# Altium schematic sheet AND_5_entradas.SchDoc
size A4; PageSetup: Record=PageOptions|CenterHorizontal=True|CenterVertical=True|PrintScale=0.97|XCorrection=1.00|YCorrection=1.00|PrintKind=2|BorderSize=5000000|LeftOffset=0|BottomOffset=0|Orientation=2|PaperLength=1000|PaperWidth=1000|Scale=100|PaperSource=7|PrintQuality=-4|MediaType=1|DitherType=10|PaperKind=A4|PrintScaleMode=1
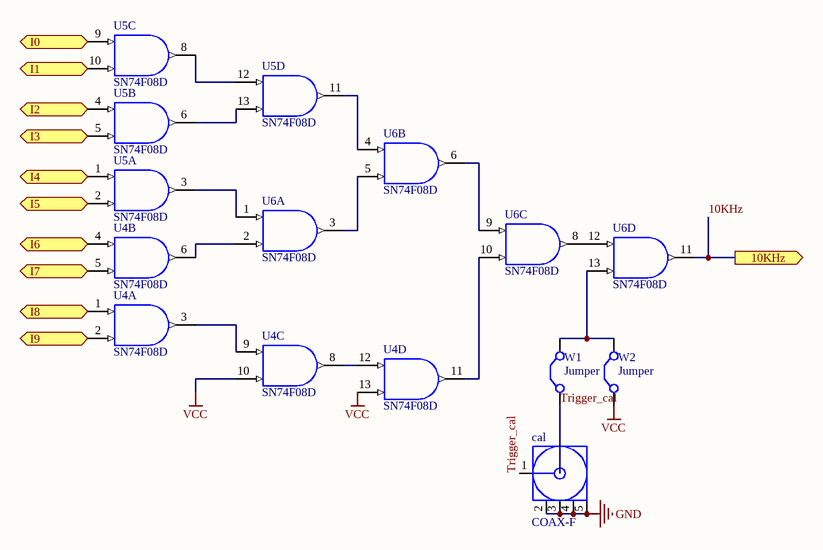
[diagram p0: AND_5_entradas.SchDoc]

## Parts
cal  COAX-F  [MCX5.08-H5]
U4  SN74F08D  [D014_N]  (parts A,B,C,D of 4)
U5  SN74F08D  [D014_N]  (parts A,B,C,D of 4)
U6  SN74F08D  [D014_N]  (parts A,B,C,D of 4)
W1  Jumper  [RAD-0.2]
W2  Jumper  [RAD-0.2]

## Ports
10KHz (out), I0 (in), I1 (in), I2 (in), I3 (in), I4 (in), I5 (in), I6 (in), I7 (in), I8 (in), I9 (in)

## Nets
GND: cal.2(GND) cal.3(GND) cal.4(GND) cal.5(GND) U4.7(GND) U5.7(GND) U6.7(GND)
VCC: U4.10(B) U4.13(B) U4.14(VCC) U5.14(VCC) U6.14(VCC) W2.1(C1)
10KHz: U6.11(Y) ; port 10KHz
I0: U5.9(A) ; port I0
I1: U5.10(B) ; port I1
I2: U5.4(A) ; port I2
I3: U5.5(B) ; port I3
I4: U5.1(A) ; port I4
I5: U5.2(B) ; port I5
I6: U4.4(A) ; port I6
I7: U4.5(B) ; port I7
I8: U4.1(A) ; port I8
I9: U4.2(B) ; port I9
Trigger_cal: cal.1(Signal) W1.1(C1)
NetU4_3: U4.3(Y) U4.9(A)
NetU4_6: U4.6(Y) U6.2(B)
NetU4_8: U4.8(Y) U4.12(A)
NetU4_11: U4.11(Y) U6.10(B)
NetU5_3: U5.3(Y) U6.1(A)
NetU5_6: U5.6(Y) U5.13(B)
NetU5_8: U5.8(Y) U5.12(A)
NetU5_11: U5.11(Y) U6.4(A)
NetU6_3: U6.3(Y) U6.5(B)
NetU6_6: U6.6(Y) U6.9(A)
NetU6_8: U6.8(Y) U6.12(A)
NetU6_13: U6.13(B) W1.2(C2) W2.2(C2)

## Library data of the parts
cal = COAX-F: RF Coaxial PCB Connector, MCX; Thru-Hole, Right-Angle Mount Socket, Blunt Post Terminal, 50 Ohm Impedance; PCB_Layout: Complies with manufacturer's recommendation.; DrillSize: Corresponds to nominal value.; Published: 15-Jul-2004; LatestRevisionDate: 15-Jul-2004; LatestRevisionNote: Component Replaced.; DatasheetDocument: 30-May-2003; PackageDocument: 04-Jul-1999; PackageReference: 919-119J-51AX; Publisher: Altium Limited; ComponentLink1Description: Manufacturer Link; ComponentLink1URL: http://www.amphenolrf.com/
U4-U6 = SN74F08D: Quadruple 2-Input Positive-AND Gate; Published: 8-Jun-2000; LatestRevisionDate: 13-Apr-2006; LatestRevisionNote: IPC-7351 Footprint Added.; DatasheetVersion: Oct-1993; PackageVersion: Jan-1998; PackageReference: D014; Publisher: Altium Limited; PackageDescription: 14-Pin Small Outline Integrated Circuit 1.27 mm Pitch; Code_IPC: SOIC127P600-14; ComponentLink1Description: Manufacturer Link; ComponentLink1URL: http://www.ti.com/; ComponentLink2Description: Datasheet; ComponentLink2URL: http://www-s.ti.com/sc/ds/SN74F08.pdf
W1 W2 = Jumper: Jumper Wire; Published: 24-Mar-1999; LatestRevisionDate: 17-Jul-2002; LatestRevisionNote: Re-released for DXP Platform.; PackageReference: RAD-0.2; Publisher: Altium Limited